# Altium schematic sheet LC - Agregation Boards (RJ-R45).SchDoc: Aggregation board - 4 x RJ-45
size A4; Version: 1.0; Variant: Variant; Modification: Mod; Project: Light Control
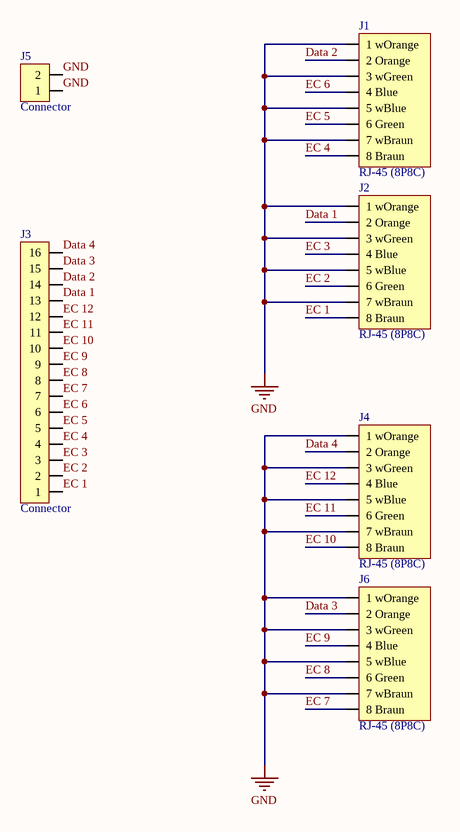
[diagram p0: LC - Agregation Boards (RJ-R45).SchDoc]

## Parts
J1  RJ-45 (8P8C)  [RJ-45]
J2  RJ-45 (8P8C)  [RJ-45]
J3  Connector  [LINE 2.54 x 16D (2 x 8) BH]
J4  RJ-45 (8P8C)  [RJ-45]
J5  Connector  [DG301 5mm 2p]
J6  RJ-45 (8P8C)  [RJ-45]

## Nets
GND: J1.1(1_wOrange) J1.3(3_wGreen) J1.5(5_wBlue) J1.7(7_wBraun) J2.1(1_wOrange) J2.3(3_wGreen) J2.5(5_wBlue) J2.7(7_wBraun) J4.1(1_wOrange) J4.3(3_wGreen) J4.5(5_wBlue) J4.7(7_wBraun) J5.1 J5.2 J6.1(1_wOrange) J6.3(3_wGreen) J6.5(5_wBlue) J6.7(7_wBraun)
Data 1: J2.2(2_Orange) J3.13
Data 2: J1.2(2_Orange) J3.14
Data 3: J3.15 J6.2(2_Orange)
Data 4: J3.16 J4.2(2_Orange)
EC 1: J2.8(8_Braun) J3.1
EC 2: J2.6(6_Green) J3.2
EC 3: J2.4(4_Blue) J3.3
EC 4: J1.8(8_Braun) J3.4
EC 5: J1.6(6_Green) J3.5
EC 6: J1.4(4_Blue) J3.6
EC 7: J3.7 J6.8(8_Braun)
EC 8: J3.8 J6.6(6_Green)
EC 9: J3.9 J6.4(4_Blue)
EC 10: J3.10 J4.8(8_Braun)
EC 11: J3.11 J4.6(6_Green)
EC 12: J3.12 J4.4(4_Blue)

## Notes on the sheet
- Ver:
- Rev:
- Sheet
- of
- File:

## Library data of the parts
J1 J2 J4 J6 = RJ-45 (8P8C): Ethernet
J3 = PLD-16 (2 x 8): Vert, Dbl line, Male
J5 = DG301-5.0-2P12: DG301 series